# EAGLE design SK8_ver3 (EAGLE 9.0.1)
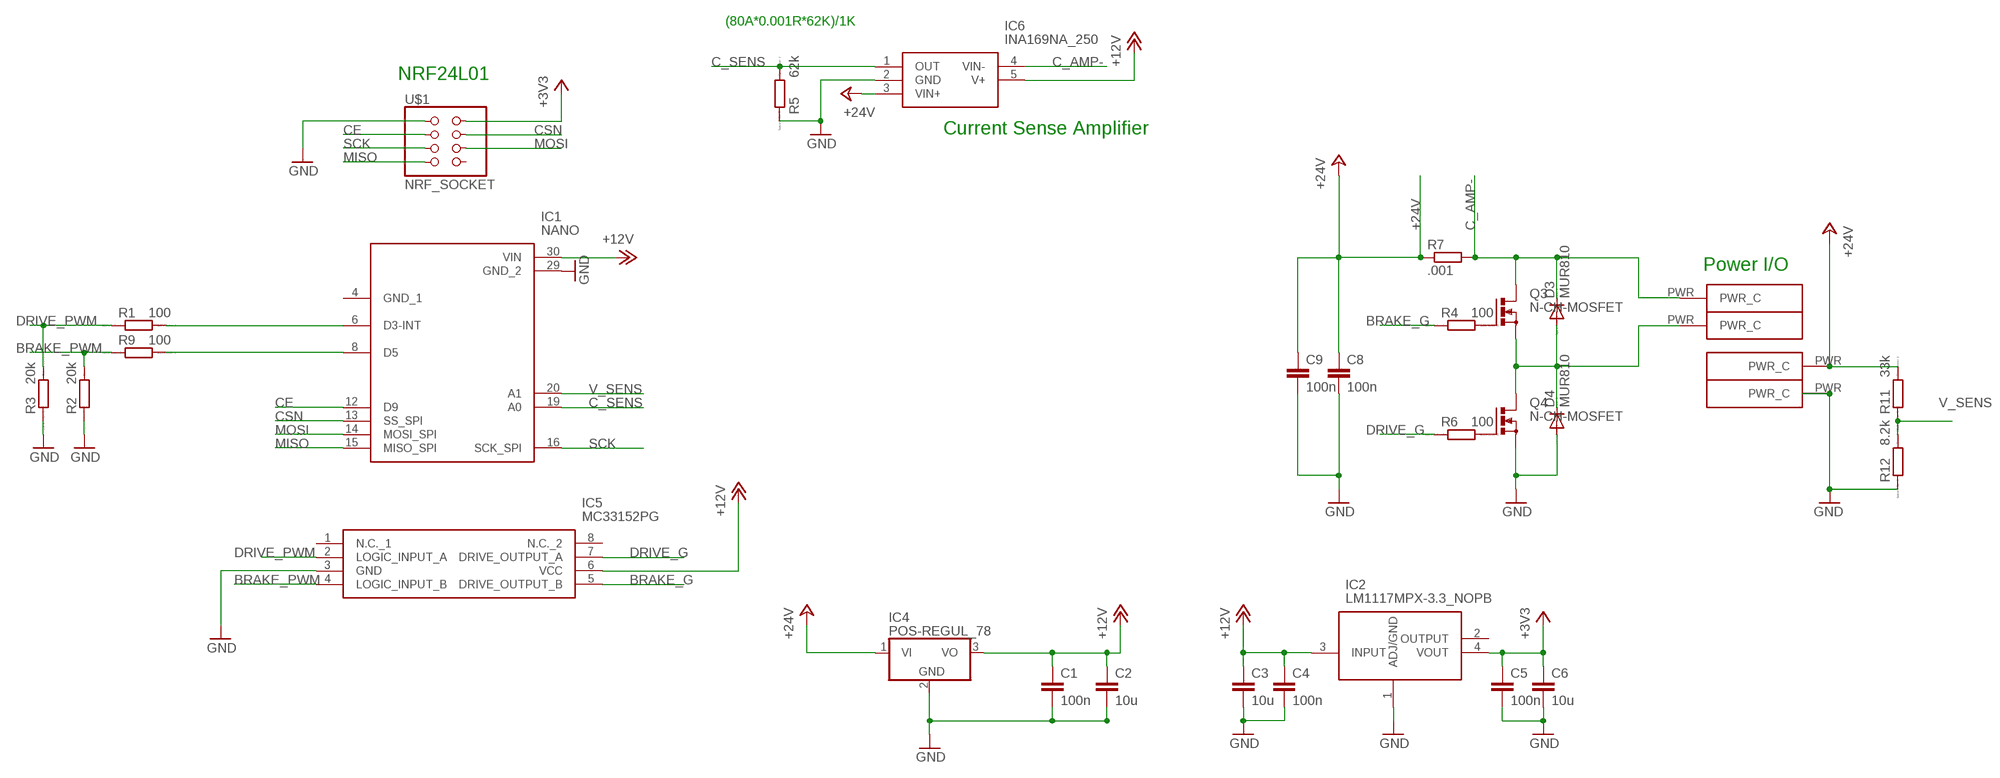
[diagram p0: schematic, sheet 1]

## Parts
C1  100n  C-EUC1206  [C1206]
C2  10u  C-EUC1206  [C1206]
C3  10u  C-EUC1206  [C1206]
C4  100n  C-EUC1206  [C1206]
C5  100n  C-EUC1206  [C1206]
C6  10u  C-EUC1206  [C1206]
C8  100n  C-EUC1206  [C1206]
C9  100n  C-EUC1206  [C1206]
D3  MUR810  [TO220ACS]
D4  MUR810  [TO220ACS]
IC1  NANO  [DIP1524W102P254L4318H762Q30N]
IC2  LM1117MPX-3.3_NOPB  [SOT230P700X180-4N]
IC4  POS-REGUL_78  [TO220V]
IC5  MC33152PG  [DIP794W56P254L959H533Q8N]
IC6  INA169NA_250  [SOT95P280X145-5N]
Q3  N-CH-MOSFET  [TO220BV]
Q4  N-CH-MOSFET  [TO220BV]
R1  100  RESISTOR-7.5MM  [0204/7]
R2  20k  RESISTOR-7.5MM  [0204/7]
R3  20k  RESISTOR-7.5MM  [0204/7]
R4  100  RESISTOR-7.5MM  [0204/7]
R5  62k  RESISTOR-7.5MM  [0204/7]
R6  100  RESISTOR-7.5MM  [0204/7]
R7  .001  R-EU_R2512  [R2512]
R9  100  RESISTOR-7.5MM  [0204/7]
R11  33k  RESISTOR-7.5MM  [0204/7]
R12  8.2k  RESISTOR-7.5MM  [0204/7]
U$1  NRF_SOCKET  [2X04]
U$2  POWERCONNECTOR  [SMD_PAD]
U$3  POWERCONNECTOR  [SMD_PAD]
U$4  POWERCONNECTOR  [SMD_PAD]
U$5  POWERCONNECTOR  [SMD_PAD]

## Nets
+3V3: C5.1 C6.1 IC2.4(VOUT) U$1.2
+12V: C1.1 C2.1 C3.1 C4.1 IC1.30(VIN) IC2.3(INPUT) IC4.3(VO) IC5.6(VCC) IC6.5(V+)
+24V: C8.1 C9.1 IC4.1(VI) IC6.3(VIN+) R7.1 R11.2 U$4.PWR(PWR_C)
BRAKE_G: IC5.5(DRIVE_OUTPUT_B) R4.1
BRAKE_PWM: IC5.4(LOGIC_INPUT_B) R2.2 R9.1
C_AMP-: D3.C IC6.4(VIN-) Q3.D R7.2 U$2.PWR(PWR_C)
C_SENS: IC1.19(A0) IC6.1(OUT) R5.2
CE: IC1.12(D9) U$1.3
CSN: IC1.13(SS_SPI) U$1.4
DRIVE_G: IC5.7(DRIVE_OUTPUT_A) R6.1
DRIVE_PWM: IC5.2(LOGIC_INPUT_A) R1.1 R3.2
GND: C1.2 C2.2 C3.2 C4.2 C5.2 C6.2 C8.2 C9.2 D4.A IC1.29(GND_2) IC2.1(ADJ/GND) IC4.2(GND) IC5.3(GND) IC6.2(GND) Q4.S R2.1 R3.1 R5.1 R12.1 U$1.1 U$5.PWR(PWR_C)
MISO: IC1.15(MISO_SPI) U$1.7
MOSI: IC1.14(MOSI_SPI) U$1.6
N$1: IC1.6(D3-INT) R1.2
N$2: IC1.8(D5) R9.2
N$3: Q3.G R4.2
N$4: D3.A D4.C Q3.S Q4.D U$3.PWR(PWR_C)
N$5: Q4.G R6.2
SCK: IC1.16(SCK_SPI) U$1.5
V_SENS: IC1.20(A1) R11.1 R12.2
Unconnected: IC2.2(OUTPUT) IC5.1(N.C._1) IC5.8(N.C._2) U$1.8

## Notes on the sheet
- (80A*0.001R*62K)/1K
- NRF24L01
- Current Sense Amplifier
- Power I/O

## Power pins joined to a net without a drawn wire
GND_1: IC1.4(GND_1)

## Library data of the parts
C1-C6 C8 C9 = resistor:C-EU: CAPACITOR, European symbol
D3 D4 = diode:MUR810: DIODE
IC1 = Nano:NANO: Development Boards & Kits - AVR ARDUINO NANO V3 A000005 Source: Datasheet <http://docs-europe.electrocomponents.com/webdocs/0db9/0900766b80db99cb.pdf>; ALLIED_NUMBER: 70518857; ALLIED_PRICE/STOCK: http://www.alliedelec.com/arduino-a000005/70518857/; ARROW_PART_NUMBER: Nano; ARROW_PRICE/STOCK: http://uk.rs-online.com/web/p/products/6961667; DESCRIPTION: Development Boards & Kits - AVR ARDUINO NANO V3 A000005; HEIGHT: 7.62mm; MANUFACTURER_NAME: Arduino; MANUFACTURER_PART_NUMBER: Nano; RS_PART_NUMBER: 6961667; RS_PRICE/STOCK: http://uk.rs-online.com/web/p/products/6961667
IC2 = LM1117MPX-3.3_NOPB:LM1117MPX-3.3_NOPB: Space Saving 800mA Low-Dropout Linear Regulator with Internal Current Limit Source: Datasheet <http://www.ti.com/lit/ds/symlink/lm1117.pdf>; ARROW_PART_NUMBER: LM1117MPX-3.3/NOPB; ARROW_PRICE/STOCK: https://www.arrow.com/en/products/lm1117mpx-3.3nopb/texas-instruments; DESCRIPTION: Space Saving 800mA Low-Dropout Linear Regulator with Internal Current Limit; HEIGHT: 1.8mm; MANUFACTURER_NAME: Texas Instruments; MANUFACTURER_PART_NUMBER: LM1117MPX-3.3/NOPB
IC4 = resistors:POS-REGUL_78
IC5 = MC33152PG:MC33152PG: ON Semiconductor MC33152PG Dual High and Low Side MOSFET Power Driver, 15mA, 6.1 18 V 8-Pin, PDIP Source: Datasheet <http://www.onsemi.com/pub/Collateral/MC34152-D.PDF>; ALLIED_NUMBER: 70340000; ALLIED_PRICE/STOCK: https://www.alliedelec.com/on-semiconductor-mc33152pg/70340000/; ARROW_PART_NUMBER: MC33152PG; ARROW_PRICE/STOCK: https://www.arrow.com/en/products/mc33152pg/on-semiconductor; DESCRIPTION: ON Semiconductor MC33152PG Dual High and Low Side MOSFET Power Driver, 15mA, 6.1 18 V 8-Pin, PDIP; HEIGHT: 5.33mm; MANUFACTURER_NAME: ON Semiconductor; MANUFACTURER_PART_NUMBER: MC33152PG; RS_PART_NUMBER: 7868705P; RS_PRICE/STOCK: http://uk.rs-online.com/web/p/products/7868705P
IC6 = INA169NA_250:INA169NA_250: 60V, High-Side, High-Speed, Current Output Current Sense Amplifier Source: Datasheet <http://www.ti.com/lit/ds/symlink/ina169.pdf>; ARROW_PART_NUMBER: INA169NA/250; ARROW_PRICE/STOCK: https://www.arrow.com/en/products/ina169na250/texas-instruments; DESCRIPTION: 60V, High-Side, High-Speed, Current Output Current Sense Amplifier; HEIGHT: 1.45mm; MANUFACTURER_NAME: Texas Instruments; MANUFACTURER_PART_NUMBER: INA169NA/250; RS_PART_NUMBER: 4616586P; RS_PRICE/STOCK: http://uk.rs-online.com/web/p/products/4616586P
Q3 Q4 = resistors:N-CH-MOSFET
R1-R6 R9 R11 R12 = resistors:RESISTOR-7.5MM
R7 = resistor:R-EU_: RESISTOR, European symbol
U$1 = resistors:NRF_SOCKET
U$2-U$5 = PWR_C:POWERCONNECTOR

## Board
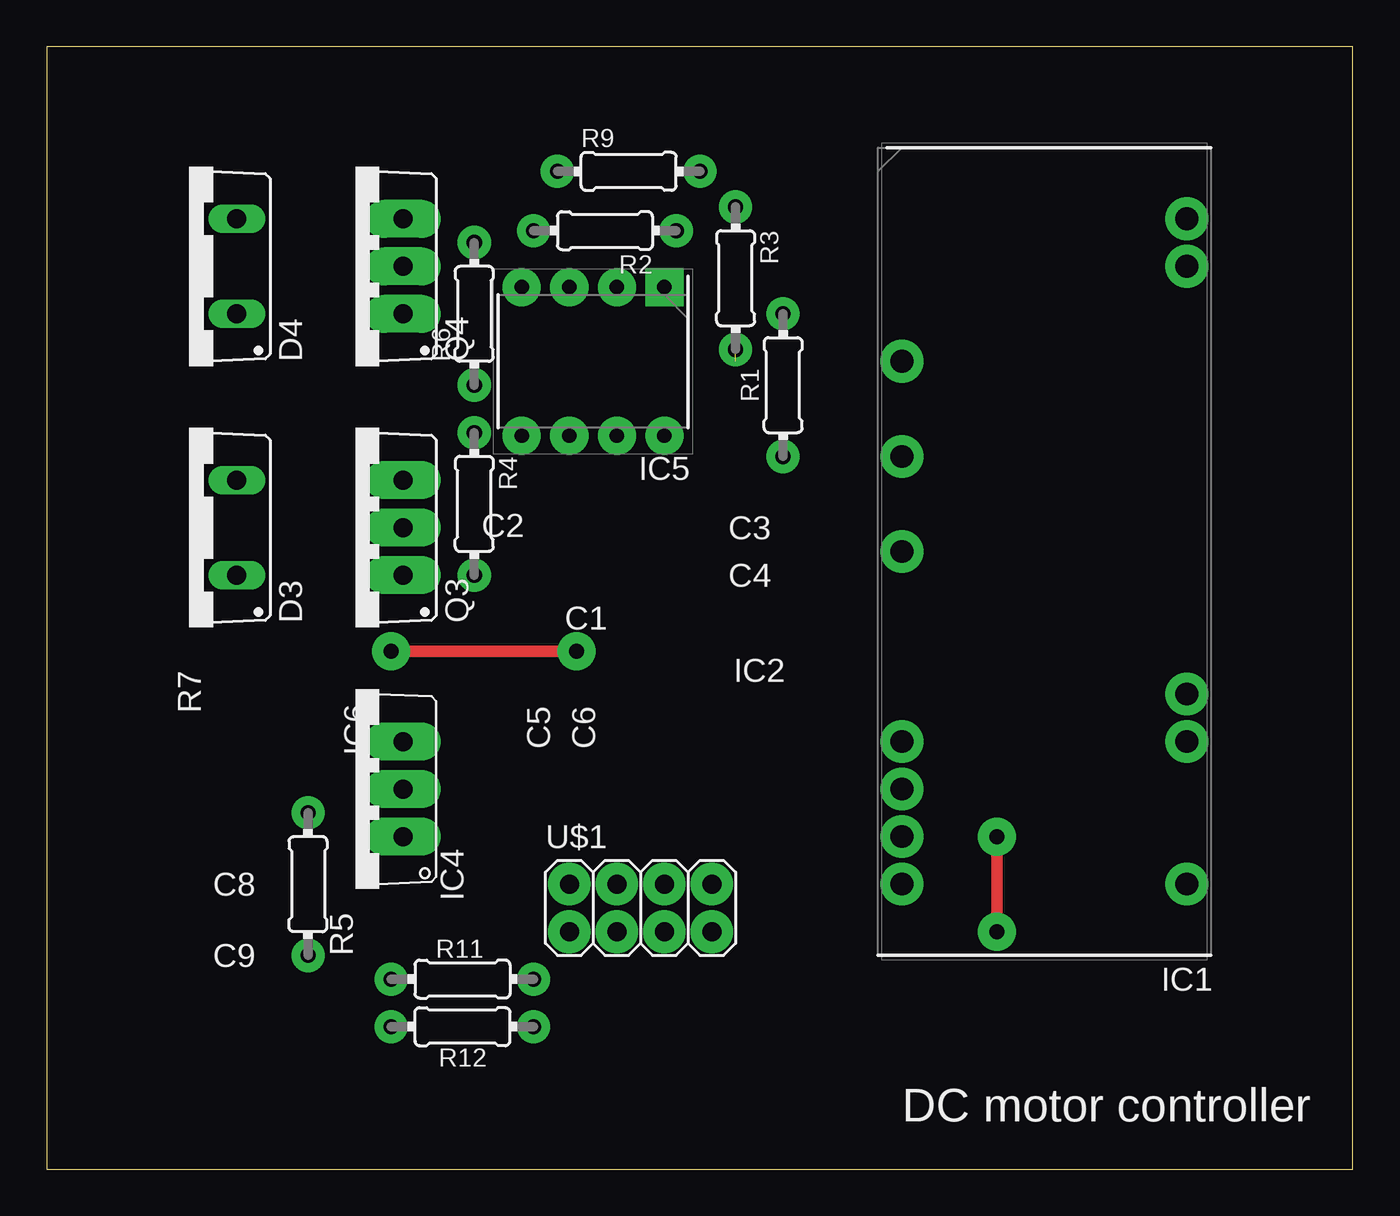
[diagram p1: board, top side]
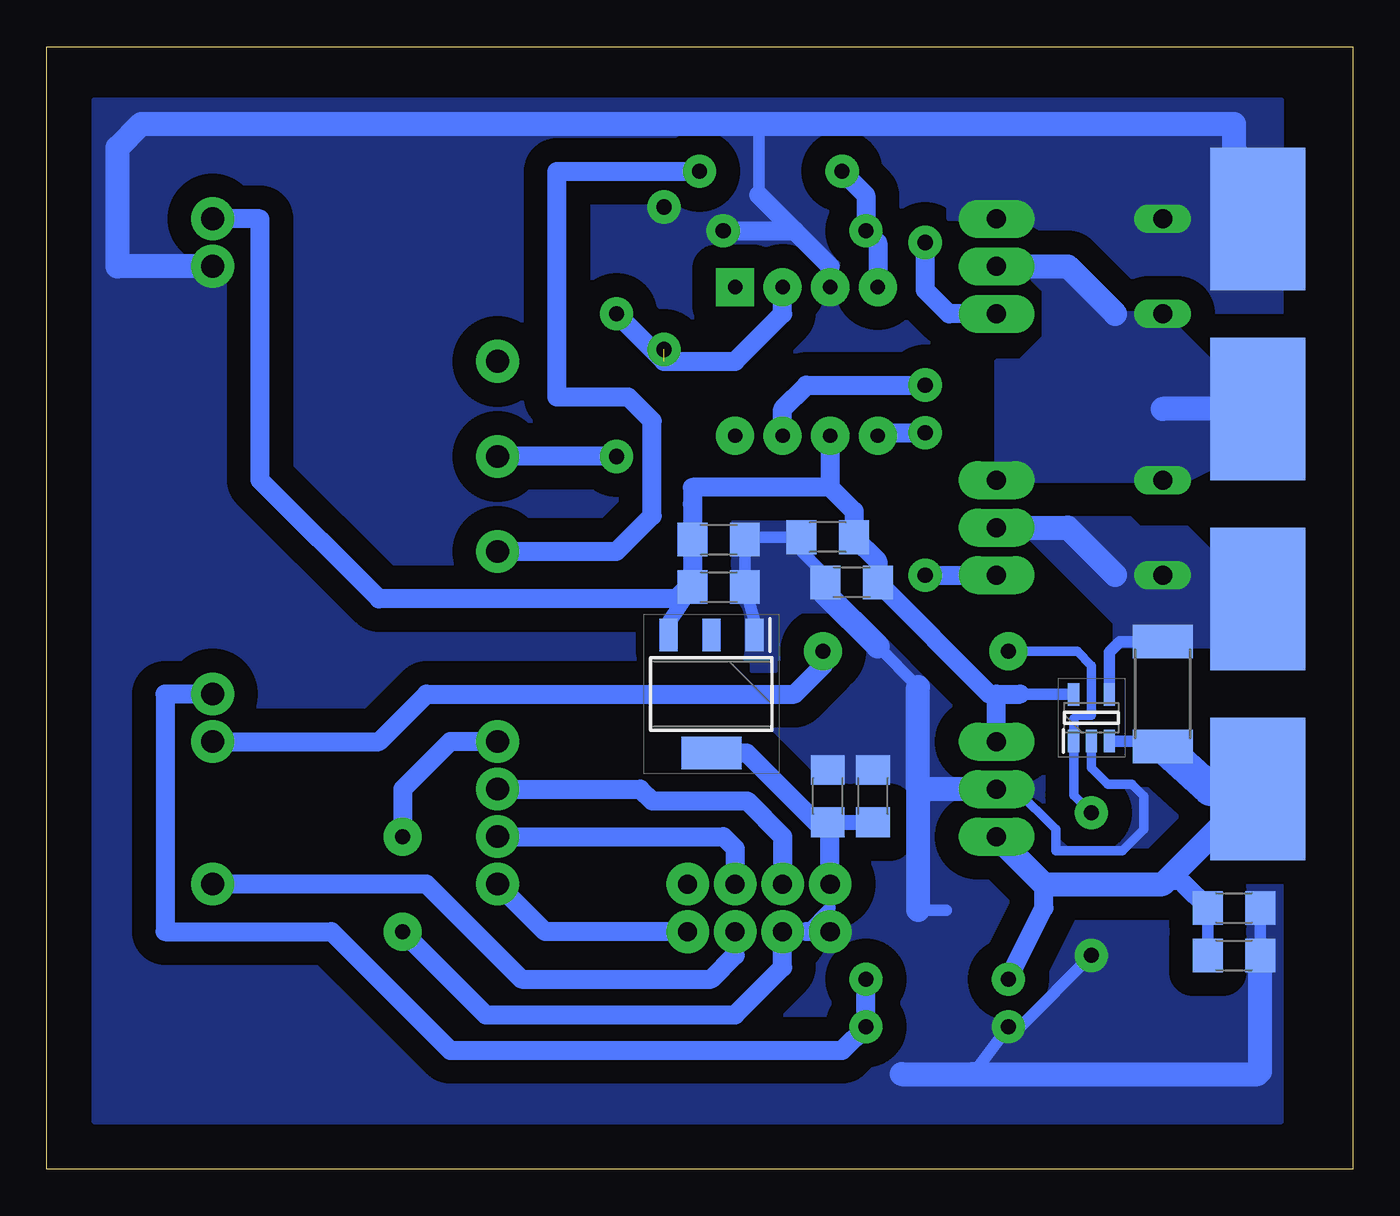
[diagram p2: board, bottom side, seen from below]

Size 69.83 x 60 mm. Coordinates in mm from the lower left corner, seen from the top.
Outline: 0,0 69.83,0 69.83,60 0,60 0,0
Copper layers (1*16): Top 0.035mm / dielectric 1.5mm / Bottom 0.035mm
Design rules "default": minimum track width 6mil, minimum drill 0.35mm, track to track 6mil, track to pad 6mil, pad to pad 6mil, via to via 6mil, smd to smd 6mil, copper to edge 40mil, drill to drill 6mil, minimum pad ring 10mil, minimum via ring 8mil, stop-mask expansion 4mil, vias tented up to drill 0mil, thermal gap 10mil

### Footprints (pad centres in the part's own frame; a part is rotated, then mirrored left to right if it is on the bottom)
C1206 = smd 1.6 x 1.8: 1 -1.4,0; 2 1.4,0
TO220ACS = drill 1.016 long: A 2.54,-2.54; C -2.54,-2.54
DIP1524W102P254L4318H762Q30N = drill 1.216 pad 2.286: 4 -7.62,10.16; 6 -7.62,5.08; 8 -7.62,0; 12 -7.62,-10.16; 13 -7.62,-12.7; 14 -7.62,-15.24; 15 -7.62,-17.78; 16 7.62,-17.78; 19 7.62,-10.16; 20 7.62,-7.62; 29 7.62,15.24; 30 7.62,17.78
SOT230P700X180-4N = smd 1.75 x 0.95: 1 -3.15,2.3; 2 -3.15,0; 3 -3.15,-2.3 | smd 1.75 x 3.2: 4 3.15,0
TO220V = drill 1.016 pad 2.032 long: 1 -2.54,-2.54; 2 0,-2.54; 3 2.54,-2.54
DIP794W56P254L959H533Q8N = drill 0.76 pad 2.032 square: 1 -3.97,3.81 | drill 0.76 pad 2.032: 2 -3.97,1.27; 3 -3.97,-1.27; 4 -3.97,-3.81; 5 3.97,-3.81; 6 3.97,-1.27; 7 3.97,1.27; 8 3.97,3.81
SOT95P280X145-5N = smd 1.2 x 0.6: 1 -1.25,0.95; 2 -1.25,0; 3 -1.25,-0.95; 4 1.25,-0.95; 5 1.25,0.95
TO220BV = drill 1.016 pad 2.032 long: D 0,-2.54; G -2.54,-2.54; S 2.54,-2.54
0204/7 = drill 0.813 pad 1.778: 1 -3.81,0; 2 3.81,0
R2512 = smd 1.8 x 3.2: 1 -2.8,0; 2 2.8,0
2X04 = drill 1.016 pad 2.286: 1 -3.81,-1.27; 2 -3.81,1.27; 3 -1.27,-1.27; 4 -1.27,1.27; 5 1.27,-1.27; 6 1.27,1.27; 7 3.81,-1.27; 8 3.81,1.27
SMD_PAD = smd 7.62 x 5.08: PWR 0,0

### Placement (x,y rotation side)
C1  26.8,31.37 180 bottom
C2  28.07,33.78 180 bottom
C3  33.91,33.66 0 bottom
C4  33.91,31.11 0 bottom
C5  25.65,19.94 90 bottom
C6  28.07,19.94 90 bottom
C8  6.35,13.97 0 bottom
C9  6.35,11.43 0 bottom
D3  7.62,34.29 90 top
D4  7.62,48.26 90 top
IC1  53.34,33.02 0 top
IC2  34.29,25.4 270 bottom
IC4  16.51,20.32 90 top
IC5  29.21,43.18 270 top
IC6  13.97,24.13 90 bottom
Q3  16.51,34.29 90 top
Q4  16.51,48.26 90 top
R1  39.37,41.91 270 top
R2  29.84,50.16 180 top
R3  36.83,47.62 270 top
R4  22.86,35.56 270 top
R5  13.97,15.24 90 top
R6  22.86,45.72 90 top
R7  10.16,25.4 90 bottom
R9  31.12,53.34 0 top
R11  22.23,10.16 180 top
R12  22.23,7.62 0 top
U$1  31.75,13.97 0 top
U$2  5.08,30.48 270 bottom
U$3  5.08,40.64 270 bottom
U$4  5.08,20.32 270 bottom
U$5  5.08,50.8 270 bottom

### Tracks (layer width: path | path; a pad name or v marks a point on that pad's centre or on a via)
+3V3
  Bottom 0.813: C6.1 C5.1
  Bottom 1.016: IC2.4 32.41,22.25 28.58,18.41 28.19,18.41 C6.1 27.94,18.41 U$1.2
+12V
  Bottom 0.61: IC6.5 19.03,25.38 19.05,25.4
  Bottom 0.813: 19.05,25.4 19.43,25.4 | 26.67,34.29 C2.1 | C4.1 36.59,29.2 IC2.3
  Bottom 1.016: IC4.3 19.05,25.4 17.78,25.4 | C2.1 25.4,32.51 C1.1 19.43,25.4 | IC5.6 27.94,36.45 | 27.94,36.45 26.67,35.18 26.67,34.29 | 27.94,36.45 35.31,36.45 35.31,35.56 C3.1 C4.1 35.56,31.11 36.2,30.48 52.07,30.48 58.42,36.83 58.42,50.8 IC1.30
+24V
  Bottom 0.61: IC6.3 10.44,22.88 R7.1 | C9.1 C8.1 | 9.02,15.24 10.16,15.24
  Bottom 1.016: R11.2 16.51,13.97 16.51,15.24 | C8.1 9.02,15.24
  Bottom 1.27: IC4.1 16.51,15.24 10.16,15.24 U$4.PWR
  Bottom 1.778: U$4.PWR 7.62,20.32 R7.1
BRAKE_G
  Bottom 1.016: IC5.5 25.24,39.37 R4.1
BRAKE_PWM
  Bottom 1.016: R9.1 26.03,52.07 R2.2 25.4,49.53 IC5.4
C_AMP-
  Bottom 0.61: IC6.4 13.02,27.62 12.44,28.2 R7.2
  Bottom 1.27: Q3.D 15.24,34.29 12.7,31.75
  Bottom 1.778: 5.08,31.75 U$2.PWR
  pour Bottom (no thermals): 18.41,33.78 18.41,34.8 11.94,34.8 11.43,34.29 8.89,34.29 6.35,31.75 6.35,27.94 12.7,27.94 12.7,29.21 17.27,33.78
C_SENS  (via drill 0.8 pad 2.03)
  Top 0.61: v18.41,27.69 v28.32,27.69
  Bottom 0.508: R5.2 14.92,20 IC6.1 14.92,24.07 14.73,24.26 13.97,24.26 13.97,26.92 14.73,27.69 v18.41,27.69
  Bottom 1.016: IC1.19 52.07,22.86 49.53,25.4 29.84,25.4 28.32,26.92 v28.32,27.69
CE  (via drill 0.8 pad 2.03)
  Top 0.61: v50.8,12.7 v50.8,17.78
  Bottom 1.016: v50.8,12.7 46.35,8.25 33.02,8.25 30.48,10.8 U$1.3 | IC1.12 48.26,22.86 50.8,20.32 v50.8,17.78
CSN
  Bottom 1.016: IC1.13 38.1,20.32 37.46,19.68 32.38,19.68 30.48,17.78 U$1.4
DRIVE_G
  Bottom 1.016: IC5.7 30.48,40.64 29.21,41.91 R6.1
DRIVE_PWM  (1 unrouted)
  Bottom 1.016: R1.1 36.83,43.18 33.02,43.18 30.48,45.72 IC5.2
GND
  Bottom 0.508: IC6.2 13.97,21.46 13.08,20.57 11.81,20.57 11.18,19.94 11.18,18.16 12.32,17.02 15.88,17.02 15.88,18.16 18.03,20.32 IC4.2
  Bottom 0.61: 29.21,12.7 27.94,13.97 | 23.24,25.78 25.4,27.94 | C1.2 28.2,31.75 29.47,33.02 C2.2 31.75,33.78 C3.2 C4.2 31.99,29.33 IC2.1 | 23.24,13.84 21.72,13.84 | R5.1 17.78,7.62 R12.1 20.32,5.08 | 31.75,52.07 31.75,55.88 | C8.2 C9.2 | 5.08,5.08 4.95,5.21
  Bottom 0.813: 28.2,30.74 C1.2
  Bottom 1.016: U$1.1 29.21,12.7 | IC5.3 27.94,48.26 29.84,50.16 | 29.84,50.16 31.75,52.07 | R2.1 29.84,50.16
  Bottom 1.27: IC4.2 23.24,20.32 | 23.24,20.32 23.24,25.78 | IC1.29 66.04,48.26 66.04,54.61 64.77,55.88 31.75,55.88 6.35,55.88 6.35,54.61 U$5.PWR | 23.24,20.32 23.24,13.84 | 24.13,5.08 20.32,5.08 5.08,5.08 | 4.95,5.21 C9.2 | 25.4,27.94 28.2,30.74
  pour Bottom (isolate 1.27, no thermals): 3.81,57.15 67.31,57.15 67.31,2.54 3.81,2.54
  pour Bottom (no thermals): 3.81,57.15 3.81,48.26 11.43,48.26 13.97,50.8 21.59,50.8 21.59,57.15
  pour Bottom (no thermals): 27.94,29.84 28.58,32.13 29.46,33.02 29.46,34.42 32.13,34.42 32.13,26.67 30.86,26.67 30.86,29.46 29.84,29.84
MISO
  Bottom 1.016: IC1.15 43.18,12.7 U$1.7
MOSI
  Bottom 1.016: IC1.14 33.66,17.78 33.02,17.14 U$1.6
N$1
  Bottom 1.016: R1.2 IC1.6
N$2
  Bottom 1.016: IC1.8 39.37,33.02 37.46,34.92 37.46,40 38.73,41.27 42.55,41.27 42.55,53.34 R9.2
N$3
  Bottom 1.016: R4.2 Q3.G
N$4
  Bottom 1.27: Q4.D 15.24,48.26 12.7,45.72 | U$3.PWR 10.16,40.64
  pour Bottom (no thermals): 10.16,45.72 12.7,45.72 15.24,48.26 17.78,48.26 16.51,46.99 16.51,44.45 17.78,43.18 19.05,43.18 19.05,36.83 8.89,36.83 6.35,38.1 6.35,43.18 7.62,43.18
N$5
  Bottom 1.016: Q4.G 21.59,45.72 22.86,46.99 R6.2
SCK
  Bottom 1.016: IC1.16 49.53,15.24 44.45,10.16 34.29,10.16 33.02,11.43 U$1.5
V_SENS
  Bottom 1.016: IC1.20 63.5,25.4 63.5,12.7 54.61,12.7 48.26,6.35 27.3,6.35 R12.2 R11.1

### Text on the board
tNames: DC motor controller